# Altium schematic sheet MCU.SchDoc
size A4; SheetNumber: 2; SheetTotal: 2
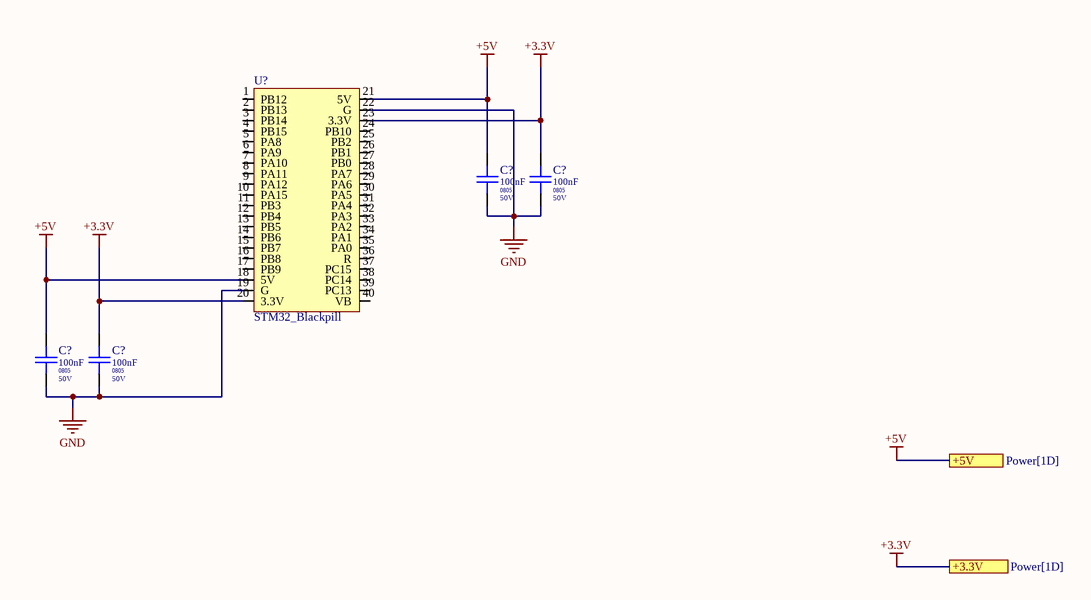
[diagram p0: MCU.SchDoc]

## Parts
(Parts that share a designator on the sheet are numbered #1, #2 ... from top to bottom, then left to right.)
C?#1  Package / Case: 0805  Voltage: 50V  [CAPC 0805]  (hidden comment: 100nF)
C?#2  Package / Case: 0805  Voltage: 50V  [CAPC 0805]  (hidden comment: 100nF)
C?#3  Package / Case: 0805  Voltage: 50V  [CAPC 0805]  (hidden comment: 100nF)
C?#4  Package / Case: 0805  Voltage: 50V  [CAPC 0805]  (hidden comment: 100nF)
U?  STM32_Blackpill  [STM32_Blackpıll]

## Ports
+3.3V (see Power[1D]), +5V (see Power[1D])

## Nets
+3.3V: C?#2.2 C?#4.2 U?.20(3.3V) U?.23(3.3V) ; port +3.3V
+5V: C?#1.2 C?#3.2 U?.18(5V) U?.21(5V) ; port +5V
GND: C?#1.1 C?#2.1 C?#3.1 C?#4.1 U?.19(G) U?.22(G)

Not connected (* = marked no-connect by the designer): U? 1(PB12) 2(PB13) 3(PB14) 4(PB15) 5(PA8) 6(PA9) 7(PA10) 8(PA11) 9(PA12) 10(PA15) 11(PB3) 12(PB4) 13(PB5) 14(PB6) 15(PB7) 16(PB8) 17(PB9) 24(PB10) 25(PB2) 26(PB1) 27(PB0) 28(PA7) 29(PA6) 30(PA5) 31(PA4) 32(PA3) 33(PA2) 34(PA1) 35(PA0) 36(R) 37(PC15) 38(PC14) 39(PC13) 40(VB)

## Library data of the parts
C?#1-C?#4 = CAPC0572: Capacitor Ceramic 100nF 50V 0805; Tolerance: %10; Value Rating: nF; Favorites: Favorite; Value: 100nF; Part Number: CAPC0572; Category: Capacitor Ceramic; Values: 100nF 50V